# EAGLE design alarmclock5 (EAGLE 7.6.0)
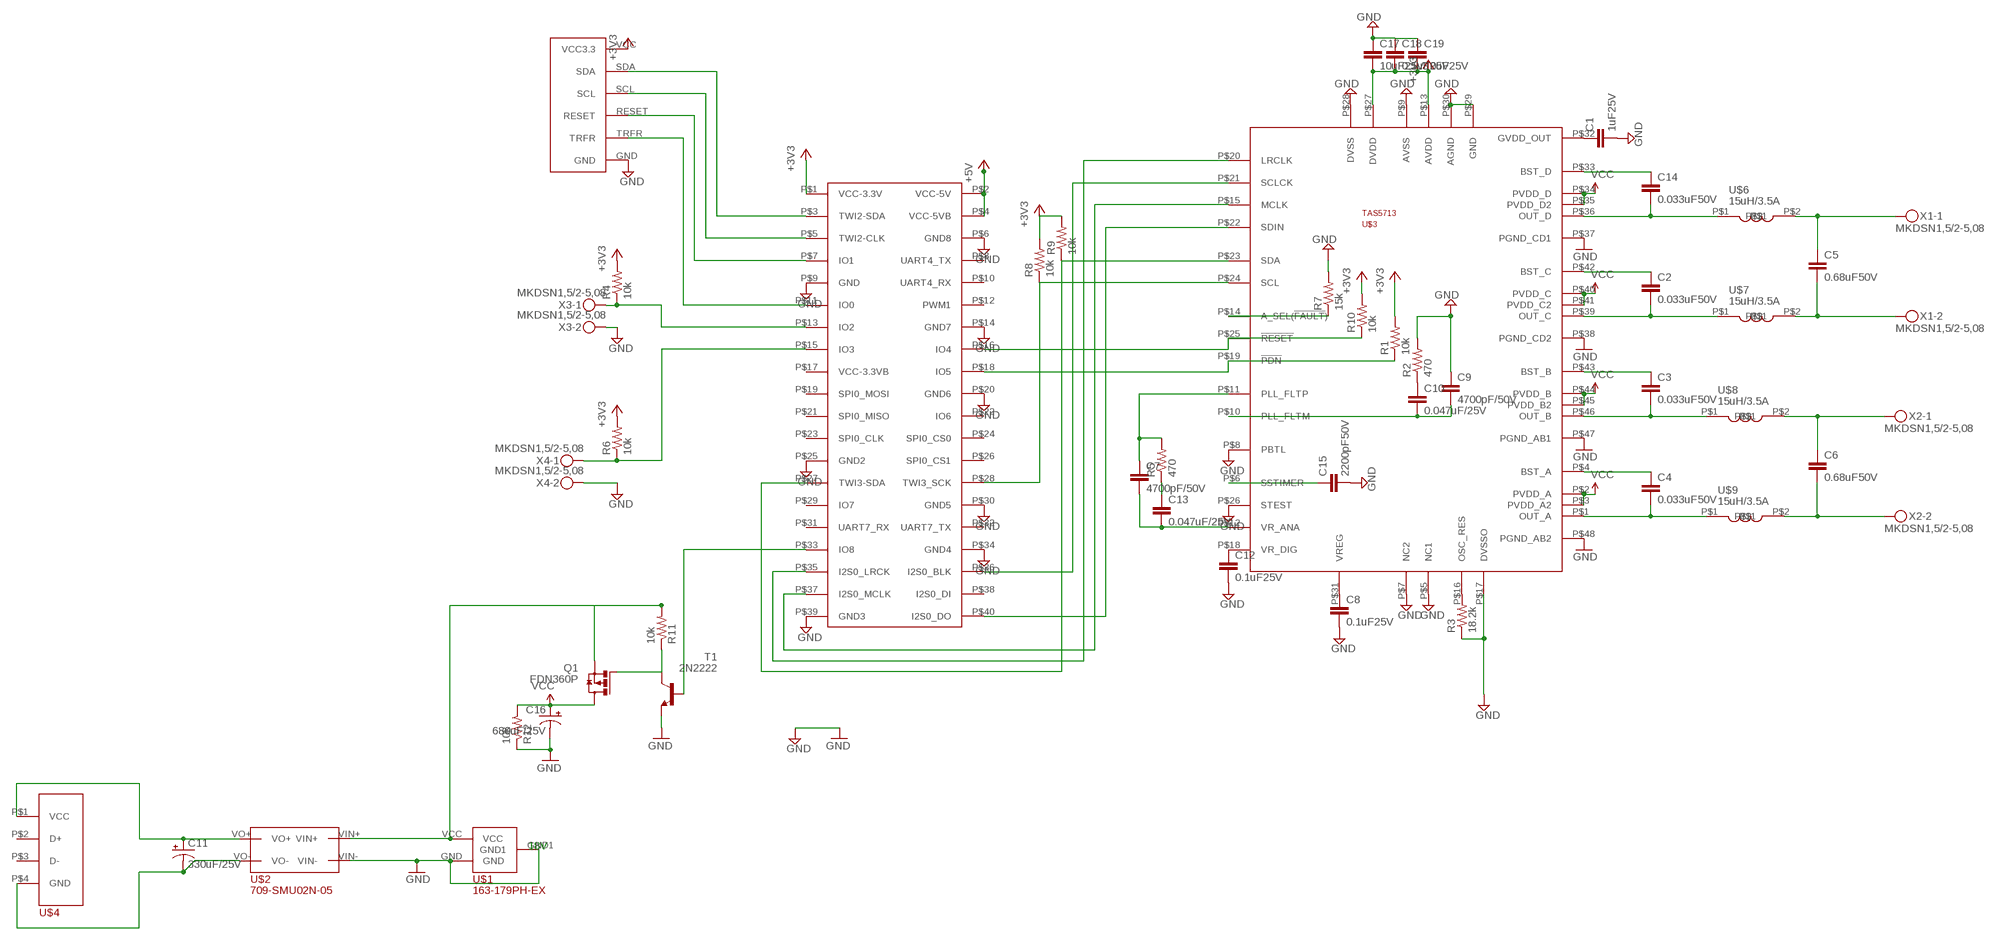
[diagram p0: schematic, sheet 1]

## Parts
C1  1uF25V  CAP0603-CAP  [0603-CAP]
C2  0.033uF50V  CAP0603-CAP  [0603-CAP]
C3  0.033uF50V  CAP0603-CAP  [0603-CAP]
C4  0.033uF50V  CAP0603-CAP  [0603-CAP]
C5  0.68uF50V  CAP0603-CAP  [0603-CAP]
C6  0.68uF50V  CAP0603-CAP  [0603-CAP]
C7  4700pF/50V  CAP0603-CAP  [0603-CAP]
C8  0.1uF25V  CAP0603-CAP  [0603-CAP]
C9  4700pF/50V  CAP0603-CAP  [0603-CAP]
C10  0.047uF/25V  CAP0603-CAP  [0603-CAP]
C11  330uF/25V  CAP_POLPTH2  [CPOL-RADIAL-10UF-25V]
C12  0.1uF25V  CAP0603-CAP  [0603-CAP]
C13  0.047uF/25V  CAP0603-CAP  [0603-CAP]
C14  0.033uF50V  CAP0603-CAP  [0603-CAP]
C15  2200pF50V  CAP0603-CAP  [0603-CAP]
C16  680uF/25V  CAP_POLPTH2  [CPOL-RADIAL-10UF-25V]
C17  10uF25V  CAP0603-CAP  [0603-CAP]
C18  0.1uF25V  CAP0603-CAP  [0603-CAP]
C19  10uF25V  CAP0603-CAP  [0603-CAP]
Q1  FDN360P  [SUPER-SOT3]
R1  10k  RESISTOR0603-RES  [0603-RES]
R2  470  RESISTOR0603-RES  [0603-RES]
R3  18.2k  RESISTOR0603-RES  [0603-RES]
R4  10k  RESISTOR0603-RES  [0603-RES]
R5  470  RESISTOR0603-RES  [0603-RES]
R6  10k  RESISTOR0603-RES  [0603-RES]
R7  15k  RESISTOR0603-RES  [0603-RES]
R8  10k  RESISTOR0603-RES  [0603-RES]
R9  10k  RESISTOR0603-RES  [0603-RES]
R10  10k  RESISTOR0603-RES  [0603-RES]
R11  10k  RESISTOR0603-RES  [0603-RES]
R12  10k  RESISTOR0603-RES  [0603-RES]
T1  2N2222  [TO18]
U$1  163-179PH-EX  [163-179PH-EX_DIM]
U$2  709-SMU02N-05  [709-SMU02N-05_DIM]
U$3  TAS5713  [TAS5713_DIM]
U$4  USB_TYPEA_CONNECTOR  [USB_DIM]
U$5  BANANAPRO-CON6  [BANANAPRO-CON6_DIM]
U$6  15uH/3.5A  MSS1260INDUCTOR  [MSS1260_DIM]
U$7  15uH/3.5A  MSS1260INDUCTOR  [MSS1260_DIM]
U$8  15uH/3.5A  MSS1260INDUCTOR  [MSS1260_DIM]
U$9  15uH/3.5A  MSS1260INDUCTOR  [MSS1260_DIM]
U$10  SKYWRITER  [SKYWRITER_DIM]
X1  MKDSN1,5/2-5,08  [MKDSN1,5/2-5,08]
X2  MKDSN1,5/2-5,08  [MKDSN1,5/2-5,08]
X3  MKDSN1,5/2-5,08  [MKDSN1,5/2-5,08]
X4  MKDSN1,5/2-5,08  [MKDSN1,5/2-5,08]

## Nets
+3V3: C17.2 C18.2 C19.2 R1.2 R4.2 R6.2 R8.2 R9.2 R10.2 U$3.P$13(AVDD) U$3.P$27(DVDD) U$5.P$1(VCC-3.3V) U$10.VCC(VCC3.3)
+5V: U$5.P$2(VCC-5V) U$5.P$4(VCC-5VB)
GND [amplified]: C1.2 C8.2 C9.1 C12.2 C15.2 C16.2(-) C17.1 C18.1 C19.1 R2.2 R3.1 R7.2 R12.1 T1.1(E) U$1.GND U$1.GND1 U$2.VIN- U$3.P$5(NC1) U$3.P$7(NC2) U$3.P$8(PBTL) U$3.P$9(AVSS) U$3.P$17(DVSSO) U$3.P$26(STEST) U$3.P$28(DVSS) U$3.P$29(GND) U$3.P$30(AGND) U$3.P$37(PGND_CD1) U$3.P$38(PGND_CD2) U$3.P$47(PGND_AB1) U$3.P$48(PGND_AB2) U$5.P$6(GND8) U$5.P$9(GND) U$5.P$14(GND7) U$5.P$20(GND6) U$5.P$25(GND2) U$5.P$30(GND5) U$5.P$34(GND4) U$5.P$39(GND3) U$10.GND X3.2 X4.2
N$1: U$3.P$22(SDIN) U$5.P$40(I2S0_DO)
N$2: U$3.P$15(MCLK) U$5.P$37(I2S0_MCLK)
N$3: C11.1(+) U$2.VO+ U$4.P$1(VCC)
N$4: U$3.P$20(LRCLK) U$5.P$35(I2S0_LRCK)
N$5: U$3.P$21(SCLCK) U$5.P$36(I2S0_BLK)
N$6: R6.1 U$5.P$15(IO3) X4.1
N$7: R3.2 U$3.P$16(OSC_RES)
N$8: R4.1 U$5.P$13(IO2) X3.1
N$9 [amplified]: C6.1 U$8.P$2 X2.1
N$10 [amplified]: C14.2 U$3.P$36(OUT_D) U$6.P$1
N$11: C14.1 U$3.P$33(BST_D)
N$12: C4.1 U$3.P$4(BST_A)
N$13 [amplified]: C4.2 U$3.P$1(OUT_A) U$9.P$1
N$14 [amplified]: C3.2 U$3.P$46(OUT_B) U$8.P$1
N$15: C3.1 U$3.P$43(BST_B)
N$16 [amplified]: C2.2 U$3.P$39(OUT_C) U$7.P$1
N$17: C2.1 U$3.P$42(BST_C)
N$18 [amplified]: C6.2 U$9.P$2 X2.2
N$19 [amplified]: C5.2 U$7.P$2 X1.2
N$20 [amplified]: C5.1 U$6.P$2 X1.1
N$21: C7.1 R5.2 U$3.P$11(PLL_FLTP)
N$22: C7.2 C13.2 U$3.P$12(VR_ANA)
N$23: C9.2 C10.2 U$3.P$10(PLL_FLTM)
N$24: C13.1 R5.1
N$25: C10.1 R2.1
N$26: C8.1 U$3.P$31(VREG)
N$27: C12.1 U$3.P$18(VR_DIG)
N$28: R1.1 U$3.P$19(!PDN!) U$5.P$18(IO5)
N$29 [amplified]: C11.2(-) U$2.VO- U$4.P$4(GND)
N$30: U$5.P$3(TWI2-SDA) U$10.SDA
N$31: U$5.P$5(TWI2-CLK) U$10.SCL
N$32: U$5.P$7(IO1) U$10.RESET
N$33: U$5.P$11(IO0) U$10.TRFR
N$34: R7.1 U$3.P$14(A_SEL(!FAULT!))
N$35: R9.1 U$3.P$23(SDA) U$5.P$27(TWI3-SDA)
N$36: R8.1 U$3.P$24(SCL) U$5.P$28(TWI3_SCK)
N$37: R10.1 U$3.P$25(!RESET!) U$5.P$16(IO4)
N$38: C1.1 U$3.P$32(GVDD_OUT)
N$39: C15.1 U$3.P$6(SSTIMER)
N$40: T1.2(B) U$5.P$33(IO8)
N$41: Q1.1(G) R11.1 T1.3(C)
N$43: Q1.2(S) R11.2 U$1.VCC U$2.VIN+
VCC [amplified]: C16.1(+) Q1.3(D) R12.2 U$3.P$2(PVDD_A) U$3.P$3(PVDD_A2) U$3.P$34(PVDD_D) U$3.P$35(PVDD_D2) U$3.P$40(PVDD_C) U$3.P$41(PVDD_C2) U$3.P$44(PVDD_B) U$3.P$45(PVDD_B2)
Unconnected: U$4.P$2(D+) U$4.P$3(D-) U$5.P$8(UART4_TX) U$5.P$10(UART4_RX) U$5.P$12(PWM1) U$5.P$17(VCC-3.3VB) U$5.P$19(SPI0_MOSI) U$5.P$21(SPI0_MISO) U$5.P$22(IO6) U$5.P$23(SPI0_CLK) U$5.P$24(SPI0_CS0) U$5.P$26(SPI0_CS1) U$5.P$29(IO7) U$5.P$31(UART7_RX) U$5.P$32(UART7_TX) U$5.P$38(I2S0_DI)

## Notes on the sheet
- 18V

## Library data of the parts
C1-C10 C12-C15 C17-C19 = SparkFun-Capacitors:CAP: Capacitor Standard 0603 ceramic capacitor, and 0.1" leaded capacitor.
C11 C16 = SparkFun-Passives:CAP_POL: Capacitor Polarized These are standard SMD and PTH capacitors. Normally 10uF, 47uF, and 100uF in electrolytic and tantalum varieties. Always verify the external diameter of the through hole cap, it varies with capacity, voltage, and manufacturer. The EIA devices should be standard.
Q1 = transistor-power:FDN360P: Single P-Channel, PowerTrench (R) MOSFET Source: http://www.fairchildsemi.com/ds/FD/FDN360P.pdf
R1-R12 = SparkFun-Passives:RESISTOR: Resistor Basic schematic elements and footprints for 0603, 1206, and PTH resistors.
T1 = transistor:2N2222: NPN TRANSISTOR
U$1 = mouser:163-179PH-EX: BARREL POWER PLUG
U$2 = mouser:709-SMU02N-05
U$3 = mouser:TAS5713
U$4 = mouser:USB_TYPEA_CONNECTOR: ref Mouser: 710-61400416021
U$5 = mouser:BANANAPRO-CON6: Mouser 571-7-534206-0
U$6-U$9 = mouser:MSS1260
U$10 = skywriter:SKYWRITER
X1-X4 = con-phoenix-508:MKDSN1,5/2-5,08: MKDSN 1,5/ 2-5,08 Printklemme Nennstrom: 13,5 A Nennspannung: 250 V Rastermaß: 5,08 mm Polzahl: 2 Anschlussart: Schraubanschluss Montage: Löten Anschlussrichtung Leiter/Platine: 0 ° Artikelnummer: 1729128 Source: http://eshop.phoenixcontact.com .. 1729128.pdf

## Net classes
1 amplified: width 0.025 mm

## Board
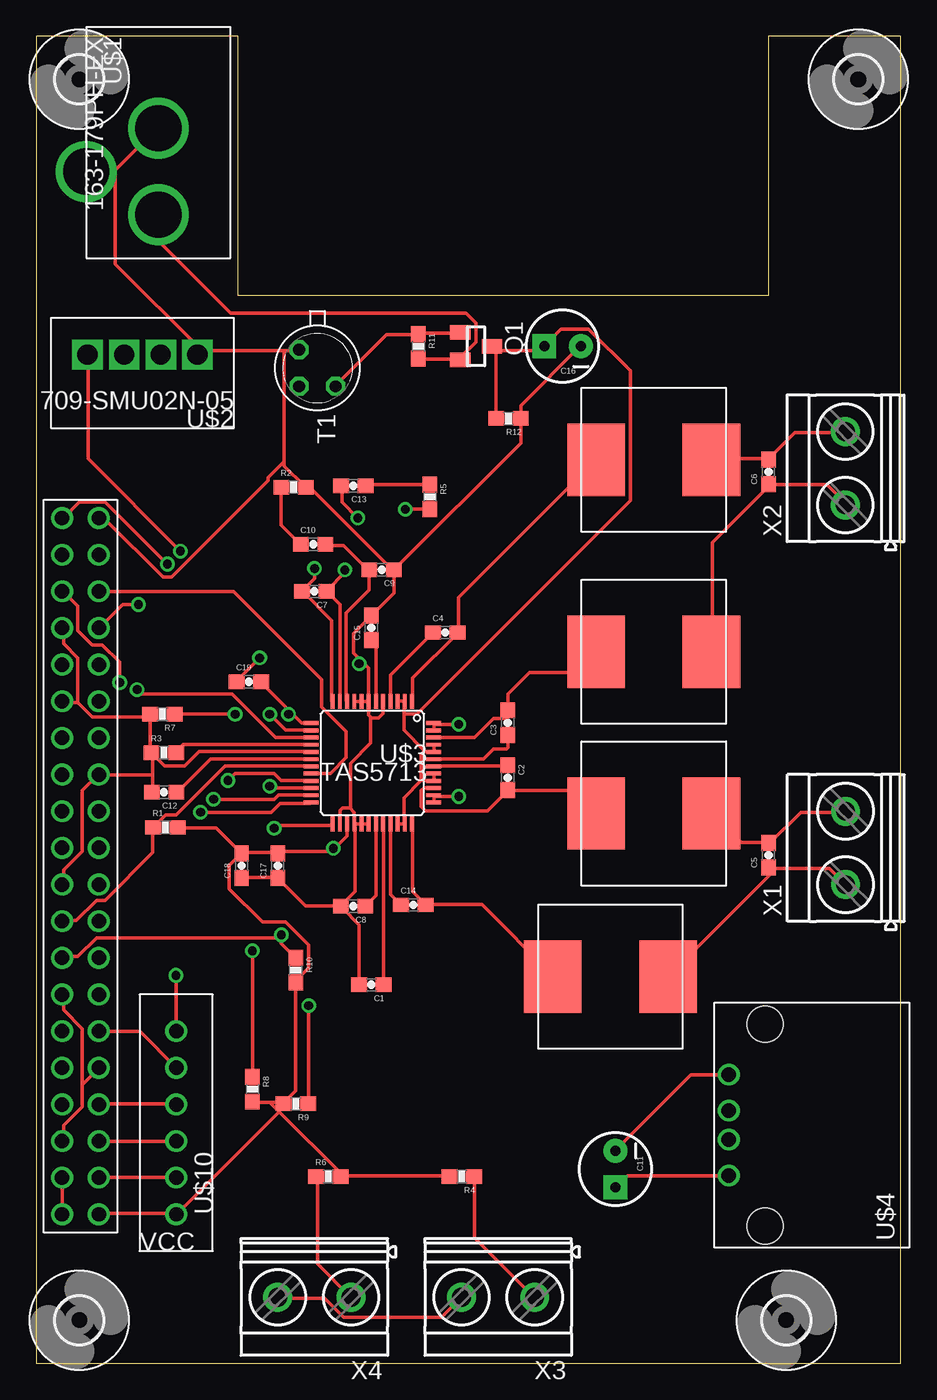
[diagram p1: board, top side]
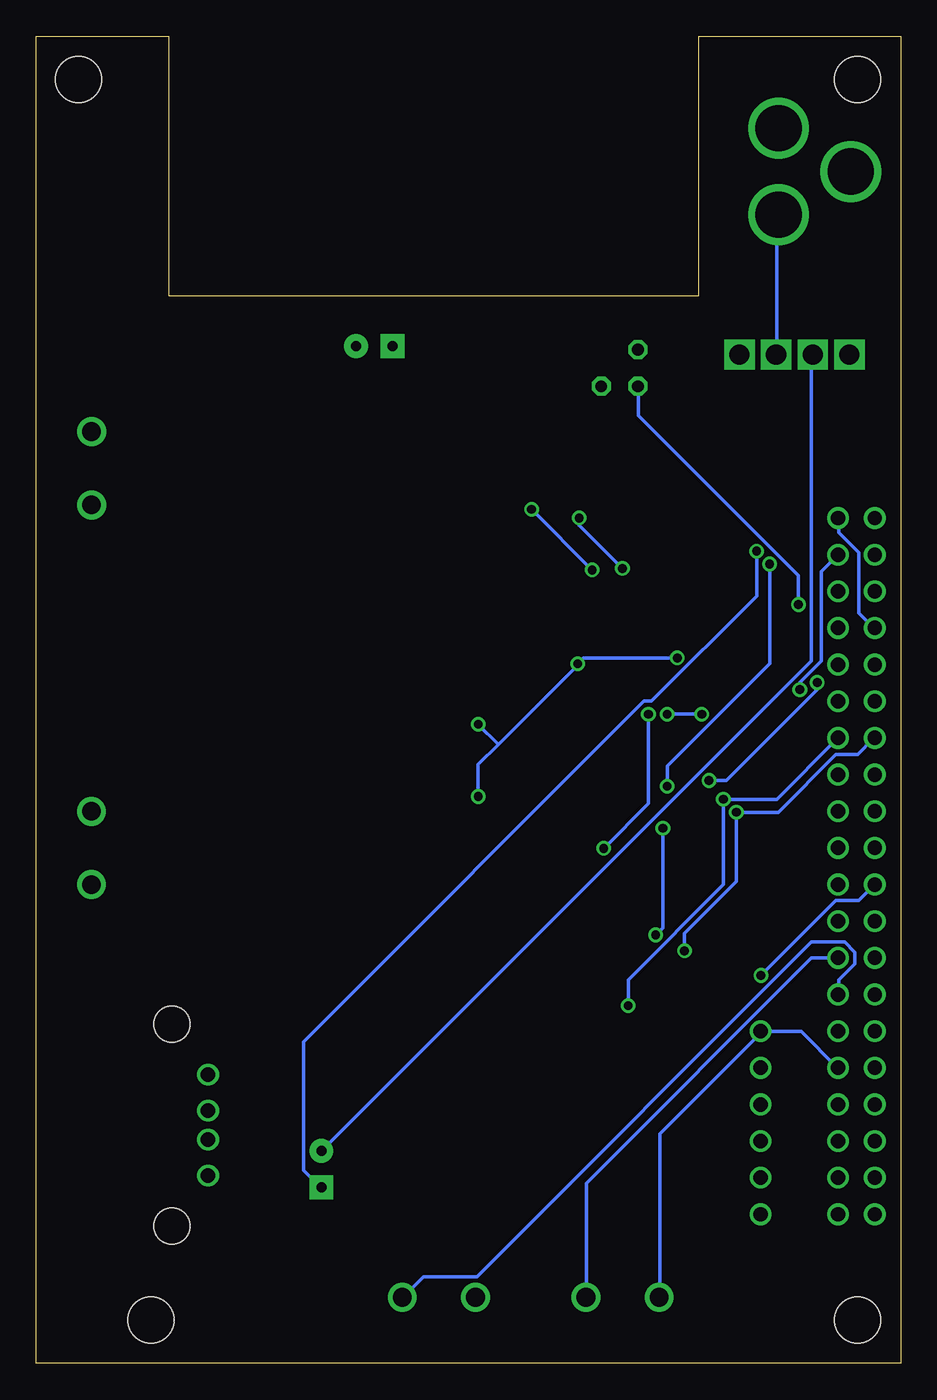
[diagram p2: board, bottom side, seen from below]

Size 59.95 x 92 mm. Coordinates in mm from the lower left corner, seen from the top.
Outline: 0,0 59.95,0 59.95,92 50.75,92 50.75,74 14,74 14,92 0,92 0,0
Copper layers (1*16): Top 0.035mm / dielectric 1.5mm / Bottom 0.035mm
Design rules "default *": minimum track width 10mil, minimum drill 24mil, track to track 8mil, track to pad 8mil, pad to pad 8mil, via to via 8mil, smd to smd 8mil, copper to edge 40mil, drill to drill 8mil, minimum pad ring 10mil, minimum via ring 8mil, stop-mask expansion 4mil, vias tented up to drill 0mil, thermal gap 10mil

### Footprints (pad centres in the part's own frame; a part is rotated, then mirrored left to right if it is on the bottom)
0603-CAP = smd 1.1 x 1: 1 -0.85,0; 2 0.85,0
CPOL-RADIAL-10UF-25V = drill 0.7 pad 1.651 square: 1 1.27,0 | drill 0.7 pad 1.651: 2 -1.27,0
SUPER-SOT3 = smd 1 x 1.4: 1 -0.95,-1.1; 2 0.95,-1.1; 3 0,1.1
0603-RES = smd 1.1 x 1: 1 -0.85,0; 2 0.85,0
TO18 = drill 0.813 octagon: 1 -1.27,-1.27; 2 1.27,-1.27; 3 1.27,1.27
163-179PH-EX_DIM = drill 3.2: GND 0,0; GND1 3,-5; VCC 6,0
709-SMU02N-05_DIM = drill 1.4 square: VIN+ -2.54,-2.54; VIN- -5.08,-2.54; VO+ 2.54,-2.54; VO- 0,-2.54
TAS5713_DIM = smd 0.27 x 1.05: P$1 -2.75,-4.25; P$2 -2.25,-4.25; P$3 -1.75,-4.25; P$4 -1.25,-4.25; P$5 -0.75,-4.25; P$6 -0.25,-4.25; P$7 0.25,-4.25; P$8 0.75,-4.25; P$9 1.25,-4.25; P$10 1.75,-4.25; P$11 2.25,-4.25; P$12 2.75,-4.25; P$25 2.75,4.25; P$26 2.25,4.25; P$27 1.75,4.25; P$28 1.25,4.25; P$29 0.75,4.25; P$30 0.25,4.25; P$31 -0.25,4.25; P$32 -0.75,4.25; P$33 -1.25,4.25; P$34 -1.75,4.25; P$35 -2.25,4.25; P$36 -2.75,4.25 | smd 1.05 x 0.27: P$13 4.25,-2.75; P$14 4.25,-2.25; P$15 4.25,-1.75; P$16 4.25,-1.25; P$17 4.25,-0.75; P$18 4.25,-0.25; P$19 4.25,0.25; P$20 4.25,0.75; P$21 4.25,1.25; P$22 4.25,1.75; P$23 4.25,2.25; P$24 4.25,2.75; P$37 -4.25,2.75; P$38 -4.25,2.25; P$39 -4.25,1.75; P$40 -4.25,1.25; P$41 -4.25,0.75; P$42 -4.25,0.25; P$43 -4.25,-0.25; P$44 -4.25,-0.75; P$45 -4.25,-1.25; P$46 -4.25,-1.75; P$47 -4.25,-2.25; P$48 -4.25,-2.75
USB_DIM = drill 1: P$1 -3,0; P$2 -0.5,0; P$3 1.5,0; P$4 4,0 | hole 2.5: -6.5,-2.5; 7.5,-2.5
BANANAPRO-CON6_DIM = drill 1: P$1 -1.27,10.16; P$2 1.27,10.16; P$3 -1.27,7.62; P$4 1.27,7.62; P$5 -1.27,5.08; P$6 1.27,5.08; P$7 -1.27,2.54; P$8 1.27,2.54; P$9 -1.27,0; P$10 1.27,0; P$11 -1.27,-2.54; P$12 1.27,-2.54; P$13 -1.27,-5.08; P$14 1.27,-5.08; P$15 -1.27,-7.62; P$16 1.27,-7.62; P$17 -1.27,-10.16; P$18 1.27,-10.16; P$19 -1.27,-12.7; P$20 1.27,-12.7; P$21 -1.27,-15.24; P$22 1.27,-15.24; P$23 -1.27,-17.78; P$24 1.27,-17.78; P$25 -1.27,-20.32; P$26 1.27,-20.32; P$27 -1.27,-22.86; P$28 1.27,-22.86; P$29 -1.27,-25.4; P$30 1.27,-25.4; P$31 -1.27,-27.94; P$32 1.27,-27.94; P$33 -1.27,-30.48; P$34 1.27,-30.48; P$35 -1.27,-33.02; P$36 1.27,-33.02; P$37 -1.27,-35.56; P$38 1.27,-35.56; P$39 -1.27,-38.1; P$40 1.27,-38.1
MSS1260_DIM = smd 5 x 4: P$1 0,4; P$2 0,-4
SKYWRITER_DIM = drill 1: GND 0,7.62; RESET 0,2.54; SCL 0,0; SDA 0,-2.54; TRFR 0,5.08; VCC 0,-5.08
3,2 = hole 3.2: 0,0
MKDSN1,5/2-5,08 = drill 1.3 pad 2: 1 -2.561,0.025; 2 2.519,0.025

### Placement (x,y rotation side)
C1  23.25,26.25 180 top
C2  32.7,40.61 270 top
C3  32.7,44.42 90 top
C4  28.37,50.66 0 top
C5  50.77,35.23 90 top
C6  50.77,61.8 90 top
C7  19.29,53.51 180 top
C8  21.98,31.69 180 top
C9  23.95,55.02 180 top
C10  19.21,56.77 0 top
C11  40.17,13.47 270 top
C12  8.88,39.6 180 top
C13  22,60.84 180 top
C14  26.15,31.78 0 top
C15  23.25,51 90 top
C16  36.5,70.5 180 top
C17  16.75,34.5 90 top
C18  14.25,34.5 90 top
C19  14.75,47.25 0 top
Q1  30.5,70.5 270 top
R1  8.97,37.15 0 top
R2  17.85,60.73 0 top
R3  8.85,42.33 0 top
R4  29.51,12.95 180 top
R5  27.3,60.08 270 top
R6  20.26,12.95 0 top
R7  8.75,45 180 top
R8  15,19 270 top
R9  18,18 180 top
R10  18,27.25 270 top
R11  26.5,70.5 270 top
R12  32.75,65.5 180 top
T1  19.5,69 270 top
U$1  8.48,85.61 270 top
U$2  6.11,67.38 180 top
U$3  23.31,41.63 180 top
U$4  48.02,16.02 90 top
U$5  3.08,20.49 180 top
U$6  39.82,26.81 90 top
U$7  42.82,38.11 90 top
U$8  42.82,49.33 90 top
U$9  42.82,62.63 90 top
U$10  9.72,15.41 0 top
U$11  [3,2]  3,3 0 top
U$12  [3,2]  57,89 0 top
U$13  [3,2]  52,3 0 top
U$15  [3,2]  3,89 0 top
X1  56.14,35.75 90 top
X2  56.13,62.06 90 top
X3  32.01,4.6 180 top
X4  19.27,4.6 180 top

### Tracks (layer width: path | path; a pad name or v marks a point on that pad's centre or on a via)
+3V3  (via drill 0.61)
  Top 0.254: U$3.P$27 21.56,36.56 20.65,35.65 | 20.65,35.65 20.5,35.5 16.9,35.5 C17.2 16.7,35.4 14.3,35.4 C18.2 | 17.65,45.15 15.6,47.2 C19.2 | 17.65,45.15 18.4,44.4 19,44.4 U$3.P$13 | C18.2 12.5,37.1 9.9,37.1 R1.2 | v17.5,45 17.65,45.15 | v20.6,35.7 20.65,35.65 | U$5.P$1 4.4,10.4 9.7,10.4 U$10.VCC 9.8,10.4 16.85,17.45 | R4.2 28.6,13 21.2,13 R6.2 21.2,13.1 16.85,17.45 | 16.3,18.1 17,18.1 17.1,18 R9.2 17.2,18.1 18,18.9 R10.2 18,26.5 18.9,27.4 18.9,29 17.3,30.6 15.7,30.6 13.4,32.9 13.4,34.5 C18.2 | 16.3,18.1 15,18.1 R8.2 | 16.85,17.45 16.3,18 16.3,18.1
  Bottom 0.254: v17.5,45 17.5,38.8 v20.6,35.7
+5V
  Top 0.254: U$5.P$2 1.8,10.4 1.8,12.8 U$5.P$4
GND  (via drill 0.61)
  Top 0.254: U$3.P$7 U$3.P$8 U$3.P$9 | U$3.P$7 23.06,48.19 22.57,48.67 | 22.57,48.67 22,49.25 22,50.6 C15.2 24.8,53.4 C9.1 | U$3.P$26 21.06,38.31 21.25,38.5 21.75,38.5 | 21.75,38.5 22.06,38.19 U$3.P$28 | U$3.P$5 24.06,45.06 23.75,44.75 23.25,44.75 | 23.25,44.75 23.06,44.94 U$3.P$7 | X4.2 16.8,4.5 20,4.5 21.3,3.2 28.1,3.2 29.4,4.5 X3.2 | 3.2,19.3 3.2,17.8 1.9,16.5 1.9,15.5 U$5.P$6 | 3.2,19.3 4.3,20.4 U$5.P$9 | 3.2,19.3 3.2,23.2 1.9,24.5 1.9,25.5 U$5.P$14 | U$5.P$20 1.9,33.2 1.9,34.2 3.2,35.5 3.2,39.7 4.3,40.8 U$5.P$25 4.4,40.8 8.1,40.8 | U$3.P$17 19,42.4 11.3,42.4 10.3,41.4 8.9,41.4 8,42.3 R3.1 | R3.1 7.9,42.4 R7.2 7.8,44.8 3.9,44.8 2.9,45.8 | 8.1,40.8 8.1,42.1 R3.1 | 8.1,40.8 8.1,39.6 C12.2 | 2.9,45.8 1.9,45.8 U$5.P$30 | 2.9,45.8 2.9,48.9 1.9,49.9 1.9,50.9 U$5.P$34 | U$1.GND 8.4,85.6 5.5,82.7 3.5,82.7 U$1.GND1 5.5,82.6 5.5,76.2 11.4,70.3 U$2.VIN- 11.2,70 11.4,70.2 17.2,70.2 | U$3.P$30 23,37.4 22.6,37.4 U$3.P$29 22.5,37.4 22.1,37.4 U$3.P$28 | C18.1 14.3,33.7 16.7,33.7 C17.1 18.7,31.7 21.1,31.7 C8.2 | C1.2 22.4,30.4 21.2,31.6 C8.2 | U$3.P$28 22.1,37.3 22.1,32.7 21.2,31.8 C8.2 | 17.2,70.2 18.2,70.2 T1.1 | C16.2 37.7,70.5 33.6,66.4 R12.1 33.6,63.8 24.9,55.1 C9.1 | U$3.P$47 27.6,43.9 27.6,44.3 U$3.P$48 27.7,44.3 v29.3,44.3 | U$3.P$37 27.6,38.9 27.6,39.3 U$3.P$38 27.7,39.3 v29.3,39.3 | v15.5,48.9 13.9,47.3 C19.1 | 22.57,48.67 v22.4,48.5 | C9.1 24.7,55 19,60.7 18.7,60.7 R2.2 18.6,60.8 17.2,62.2 17.2,62.4 | 17.2,62.4 17.2,70.2 | 21.75,38.5 21.8,38.6 21.8,41.6 23.2,43 23.2,44.7 23.25,44.75 | U$5.P$39 4.4,58.5 4.8,58.5 8.8,54.5 9.4,54.5 16.1,61.2 16.1,61.4 17.1,62.4 17.2,62.4 | v9.7,26.9 9.7,23.1 U$10.GND
  Bottom 0.254: U$5.P$9 4.4,20.5 6.9,23 9.7,23 U$10.GND 9.7,22.9 16.7,15.9 16.7,4.6 X4.2 | U$5.P$39 4.3,58.5 4.3,57.6 2.9,56.2 2.9,52 1.9,51 U$5.P$34 | v15.5,48.9 22,48.9 v22.4,48.5 22.4,48.4 27.9,42.9 | v29.3,39.3 29.3,41.5 27.9,42.9 | 27.9,42.9 v29.3,44.3 | v9.7,26.9 4.5,32.1 2.9,32.1 1.9,33.1 U$5.P$20
N$1  (via drill 0.61)
  Top 0.254: v16.2,40 16.3,39.9 19,39.9 U$3.P$22 | v9.1,55.4 4.8,59.7 3,59.7 1.9,58.6 U$5.P$40
  Bottom 0.254: v16.2,40 16.2,41.4 9.1,48.5 v9.1,55.4
N$2  (via drill 0.61)
  Top 0.254: v7,46.7 7.3,46.4 13.6,46.4 16.6,43.4 19,43.4 U$3.P$15
  Bottom 0.254: v7,46.7 7,47.2 5.5,48.7 5.5,54.9 4.4,56 U$5.P$37
N$3  (via drill 0.61)
  Top 0.254: U$4.P$1 48,13 41,13 40.2,12.2 C11.1 | v10,56.3 3.6,62.7 3.6,69.9 U$2.VO+
  Bottom 0.254: v10,56.3 10,53.2 17.3,45.9 17.8,45.9 41.4,22.3 41.4,13.4 40.2,12.2 C11.1
N$4
  Top 0.254: U$5.P$35 4.4,53.5 13.7,53.5 19.8,47.4 19.8,45.5 21.5,43.8 21.5,42 20.4,40.9 19.1,40.9 U$3.P$20
N$5  (via drill 0.61)
  Top 0.254: v13.3,40.4 13.8,40.9 16.5,40.9 17,40.4 19,40.4 U$3.P$21 | v5.8,47.2 5.8,48.6 4.6,49.8 3.9,49.8 2.9,50.8 2.9,52.5 1.9,53.5 U$5.P$36
  Bottom 0.254: v13.3,40.4 12.1,40.4 5.8,46.7 v5.8,47.2
N$6
  Top 0.254: R6.1 19.5,12.9 19.5,6.9 21.8,4.6 X4.1
  Bottom 0.254: U$5.P$15 4.4,28.1 6.2,28.1 21.8,12.5 21.8,4.6 X4.1
N$7
  Top 0.254: U$3.P$16 19,42.9 10.2,42.9 9.7,42.4 R3.2
N$8
  Top 0.254: R4.1 30.4,12.9 30.4,8.7 34.5,4.6 X3.1
  Bottom 0.254: U$5.P$13 4.3,25.6 4.3,26.6 3.2,27.7 3.2,28.5 3.9,29.2 6.2,29.2 29.4,6 33.1,6 34.5,4.6 X3.1
N$9
  Top 0.254: X2.1 56.1,59.6 54.8,60.9 50.8,60.9 C6.1 50.8,60.8 46.9,56.9 46.9,49.4 U$8.P$2
N$10
  Top 0.254: U$3.P$36 26.1,37.3 26.1,32.7 27,31.8 C14.2 27.1,31.8 30.9,31.8 35.8,26.9 U$6.P$1
N$11
  Top 0.254: U$3.P$33 24.56,32.52 C14.1
N$12
  Top 0.254: U$3.P$4 24.56,47.7 C4.1
N$13
  Top 0.254: U$3.P$1 26.1,45.9 26.1,47.5 29.2,50.6 C4.2 29.3,50.7 29.3,53.1 38.8,62.6 U$9.P$1
N$14
  Top 0.254: U$3.P$46 27.6,43.4 30.4,43.4 31.7,44.7 32.6,44.7 32.7,44.8 C3.2 32.7,46.4 34.2,47.9 38.7,47.9 38.8,48 38.8,49.3 U$8.P$1
N$15
  Top 0.254: C3.1 32.7,42.7 32.6,42.6 31.7,42.6 31,41.9 27.6,41.9 U$3.P$43
N$16
  Top 0.254: U$3.P$39 27.5,39.9 26.9,39.9 26.7,39.7 26.7,38.6 27,38.3 31.3,38.3 32.7,39.7 C2.2 32.8,39.7 37.3,39.7 38.8,38.2 U$7.P$1
N$17
  Top 0.254: U$3.P$42 27.6,41.4 32.7,41.4 C2.1
N$18
  Top 0.254: U$9.P$2 46.9,62.7 50.7,62.7 C6.2 50.8,62.7 52.6,64.5 56.1,64.5 X2.2
N$19
  Top 0.254: U$7.P$2 46.9,38.1 48.9,36.1 50.7,36.1 C5.2 50.9,36.1 53,38.2 56.1,38.2 X1.2
N$20
  Top 0.254: X1.1 56.1,33.2 55,34.3 50.8,34.3 C5.1 51.2,34.2 43.9,26.9 U$6.P$2
N$21  (via drill 0.61)
  Top 0.254: U$3.P$11 21.06,52.59 C7.1 20.2,53.6 21.4,54.8 v21.4,55 | v25.6,59.2 27.2,59.2 R5.2
  Bottom 0.254: v21.4,55 v25.6,59.2
N$22  (via drill 0.61)
  Top 0.254: U$3.P$12 20.5,45.9 20.5,51.5 18.5,53.5 C7.2 18.5,53.6 19.3,54.4 v19.3,55.1 | v22.3,58.6 21.2,59.7 21.2,60.8 C13.2
  Bottom 0.254: v22.3,58.6 22.3,58.1 v19.3,55.1
N$23
  Top 0.254: U$3.P$10 21.5,45.94 21.5,52 23.1,53.6 C9.2 23,55 21.3,56.7 20.1,56.7 C10.2
N$24
  Top 0.254: C13.1 22.9,60.9 27.2,60.9 R5.1
N$25
  Top 0.254: R2.1 17,58.1 18.3,56.8 C10.1
N$26
  Top 0.254: U$3.P$31 23.56,32.42 C8.1
N$27
  Top 0.254: U$3.P$18 19,41.9 12.1,41.9 9.8,39.6 C12.1
N$28
  Top 0.254: U$3.P$19 19,41.4 13.1,41.4 9.7,38 9,38 8.2,37.2 R1.1 8.1,37.1 8.1,35.4 4.8,32.1 4.2,32.1 2.8,30.7 1.9,30.7 U$5.P$18
N$29
  Top 0.254: U$4.P$4 48,20 45.4,20 40.2,14.8 C11.2
  Bottom 0.254: U$2.VO- 6.2,69.9 6.2,48.7 40.1,14.8 C11.2
N$30
  Top 0.254: U$5.P$3 4.4,12.9 9.7,12.9 U$10.SDA
N$31
  Top 0.254: U$5.P$5 4.4,15.4 9.7,15.4 U$10.SCL
N$32
  Top 0.254: U$5.P$7 4.4,18 9.7,18 U$10.RESET
N$33
  Top 0.254: U$5.P$11 4.4,23 7.2,23 9.7,20.5 U$10.TRFR
N$34  (via drill 0.61)
  Top 0.254: v16.2,45 17.3,43.9 19,43.9 U$3.P$14 | R7.1 v13.8,45
  Bottom 0.254: v13.8,45 v16.2,45
N$35  (via drill 0.61)
  Top 0.254: v12.3,39.1 16.5,39.1 16.8,39.4 19,39.4 U$3.P$23 | v18.9,24.8 18.9,18 R9.1
  Bottom 0.254: U$5.P$27 4.4,43.3 8.6,39.1 v12.3,39.1 12.3,33.2 18.9,26.6 v18.9,24.8
N$36  (via drill 0.61)
  Top 0.254: v11.4,38.2 16.3,38.2 16.9,38.8 19,38.8 U$3.P$24 | v15,28.6 R8.1
  Bottom 0.254: U$5.P$28 1.9,43.3 3,42.2 4.5,42.2 8.5,38.2 v11.4,38.2 11.4,33.4 15,29.8 v15,28.6
N$37  (via drill 0.61)
  Top 0.254: v16.5,37.1 16.7,37.3 20.5,37.3 U$3.P$25 | R10.1 17,29.1 v17,29.7 16.9,29.5 4.2,29.5 2.9,28.2 1.9,28.2 U$5.P$16
  Bottom 0.254: v16.5,37.1 16.5,30.2 v17,29.7
N$38
  Top 0.254: U$3.P$32 24.1,37.38 C1.1
N$39
  Top 0.254: U$3.P$6 23.56,49.84 C15.1
N$40  (via drill 0.61)
  Top 0.254: v7.1,52.6 6,52.6 4.4,51 U$5.P$33
  Bottom 0.254: v7.1,52.6 7.1,54.6 18.2,65.7 18.2,67.7 T1.2
N$41
  Top 0.254: Q1.1 29.4,71.4 26.5,71.4 R11.1 26.4,71.3 24.3,71.3 20.8,67.8 T1.3
N$43
  Top 0.254: R11.2 26.5,69.6 29.4,69.6 Q1.2 29.4,69.7 30.5,70.8 30.5,72.1 29.8,72.8 13.5,72.8 8.5,77.8 8.5,79.6 U$1.VCC
  Bottom 0.254: U$2.VIN+ 8.6,70 8.6,79.5 8.5,79.6 U$1.VCC
VCC
  Top 0.254: U$3.P$3 25.1,45.9 25.5,45.9 U$3.P$2 25.5,45.8 25.5,45 | U$3.P$45 27.6,42.8 27.6,42.4 U$3.P$44 27.5,42.4 26.9,42.4 | U$3.P$34 25.1,37.4 25.5,37.4 U$3.P$35 25.5,37.5 25.5,39.2 26.7,40.4 | U$3.P$41 27.6,40.8 27.6,40.4 U$3.P$40 27.5,40.4 26.7,40.4 | 26.9,42.4 26.7,42.2 26.7,40.4 | 25.5,45 25.5,43.9 26.9,42.5 26.9,42.4 | R12.2 31.9,70.2 Q1.3 32,70.2 34.9,70.2 35.2,70.5 C16.1 35.3,70.6 36.4,71.7 38.3,71.7 41.2,68.8 41.2,59.8 26.4,45 25.5,45